# Altium schematic sheet FPGA_CFG.SchDoc
size A4; SheetNumber: 1; SheetTotal: 8
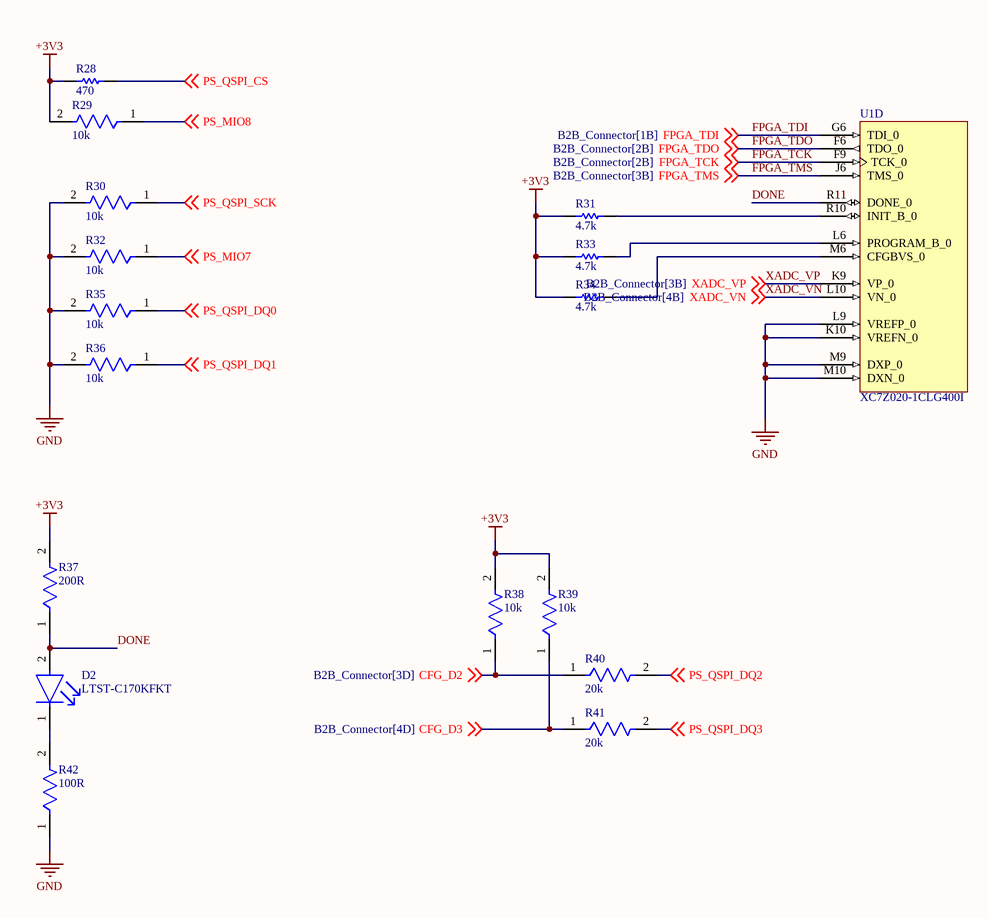
[diagram p0: FPGA_CFG.SchDoc]

## Parts
D2  LTST-C170KFKT  [FP-LTST-C170KFKT-MFG]
R28  470  [RESC1608X55X25LL10T15]
R29  10k  [FP-RC0603-0_55-IPC_C]
R30  10k  [FP-RC0603-0_55-IPC_C]
R31  4.7k  [RESC1608X55X25LL10T15]
R32  10k  [FP-RC0603-0_55-IPC_C]
R33  4.7k  [RESC1608X55X25LL10T15]
R34  4.7k  [RESC1608X55X25LL10T15]
R35  10k  [FP-RC0603-0_55-IPC_C]
R36  10k  [FP-RC0603-0_55-IPC_C]
R37  200R  [FP-ERA3A-IPC_C]
R38  10k  [FP-RC0603-0_55-IPC_C]
R39  10k  [FP-RC0603-0_55-IPC_C]
R40  20k  [FP-RT0603-MFG]
R41  20k  [FP-RT0603-MFG]
R42  100R  [FP-RC0603-0_55-MFG]
U1  XC7Z020-1CLG400I  [CLG400]  (part D of 9)

## Nets
+3V3: R28.2 R29.2 R31.2 R33.2 R34.2 R37.2 R38.2 R39.2
GND: R30.2 R32.2 R35.2 R36.2 R42.1 U1.K10(VREFN_0) U1.L9(VREFP_0) U1.M9(DXP_0) U1.M10(DXN_0)
CFG_D2: R38.1 R40.1 ; off-sheet CFG_D2
CFG_D3: R39.1 R41.1 ; off-sheet CFG_D3
DONE: D2.2(A) R37.1 U1.R11(DONE_0)
FPGA_TCK: U1.F9(TCK_0) ; off-sheet FPGA_TCK
FPGA_TDI: U1.G6(TDI_0) ; off-sheet FPGA_TDI
FPGA_TDO: U1.F6(TDO_0) ; off-sheet FPGA_TDO
FPGA_TMS: U1.J6(TMS_0) ; off-sheet FPGA_TMS
PS_MIO7: R32.1 ; off-sheet PS_MIO7
PS_MIO8: R29.1 ; off-sheet PS_MIO8
PS_QSPI_CS: R28.1 ; off-sheet PS_QSPI_CS
PS_QSPI_DQ0: R35.1 ; off-sheet PS_QSPI_DQ0
PS_QSPI_DQ1: R36.1 ; off-sheet PS_QSPI_DQ1
PS_QSPI_DQ2: R40.2 ; off-sheet PS_QSPI_DQ2
PS_QSPI_DQ3: R41.2 ; off-sheet PS_QSPI_DQ3
PS_QSPI_SCK: R30.1 ; off-sheet PS_QSPI_SCK
XADC_VN: U1.L10(VN_0) ; off-sheet XADC_VN
XADC_VP: U1.K9(VP_0) ; off-sheet XADC_VP
NetD2_1: D2.1(C) R42.2
NetR31_1: R31.1 U1.R10(INIT_B_0)
NetR33_1: R33.1 U1.L6(PROGRAM_B_0)
NetR34_1: R34.1 U1.M6(CFGBVS_0)

## Library data of the parts
D2 = CMP-22017-000036-1: LED ORANGE CLEAR SMD; Forward Current: 30mA; Reverse Voltage: 5V; Forward Voltage: 2V; Lens Style: Diffused; Number of Elements: 1; Test Current: 20mA; Lens Color: Colorless; Viewing Angle: 130°; Dominant Wavelength: 605nm; Luminous Intensity: 60mcd; Power Rating: 75mW; Wavelength: 611nm; Min Operating Temperature: -55°C; Packaging: Tape and Reel; Case Code (Metric): 2012; Depth: 1.6mm; Case Code (Imperial): 0805; Mount: Surface Mount; Radiation Hardening: No; Lens Transparency: Clear; Color: Orange; Package Quantity: 1; Illumination Color: Orange; Lead Free: Lead Free; Number of LEDs: 1; Length: 3.2mm; Height: 1.1mm; Number of Pins: 2; Width: 1.25mm; Case/Package: 0805; Power Dissipation: 75mW; Max Operating Temperature: 85°C
R28 = CMP-1659-00035-2: General Purpose Chip Resistor, 470 Ohm, +/- 1%, -55 to 155 degC, 0603 (1608 Metric), RoHS, Tape and Reel; Resistance: 470 Ohm; ComponentLink1Description: Manufacturer URL; Contact Plating: Gold; Width: 3.1 mm; Radiation Hardening: No; DatasheetVersion: Rev. 4, 04/2009; Length: 3 mm; PackageDescription: 2-Pin Surface Mount Device, Body 1.6 x 0.8 mm; ComponentLink1URL: http://www.yageo.com/; Min Operating Temperature: -40 degC; Mount: Surface Mount; Package Quantity: 2500; ComponentLink2URL: https://datasheet.ciiva.com/11808/0900766b80f96399-11808177.pdf; RoHSCompliant: true; Fastening Type: Snap; PackageReference: 0603; Max Operating Temperature: 90 degC; Height: 1.25 mm; Packaging: Tape and Reel; ComponentLink2Description: Datasheet; Contact Material: Brass
R29 R30 R32 R35 R36 R38 R39 = CMP-2100-03664-2: RES 10K OHM 1% 1/10W 0603; Voltage Rating: 75V; Voltage Rating (DC): 50V; Resistance: 10kR; Power Rating: 100mW; Temperature Coefficient: 100ppm/°C; Depth: 0.8mm; Termination: SMD/SMT; Resistor Type: Thick Film; Series: RC; Construction: Rectangular; Features: Moisture Resistant; Packaging: Tape and Reel; Min Operating Temperature: -55°C; Number of Terminations: 2; Lead Pitch: 0.3mm; RoHS Compliant: Yes; Case/Package: 0603; Resistance Tolerance: 1%; Military Standard: Not; Weight: 7.1E-05oz; Number of Pins: 2; Tolerance: 1%; Length: 1.6mm; Case Code (Imperial): 0603; Lead Free: Lead Free; Width: 0.8mm; Max Power Dissipation: 100mW; Height: 0.45mm; Max Operating Temperature: 155°C; Case Code (Metric): 1608; Size Code: 0603
R31 R33 R34 = CMP-2000-06942-1: Chip Resistor, 4.7 KOhm, +/- 1%, 0.1 W, -55 to 155 degC, 0603 (1608 Metric), RoHS, Tape and Reel; Manufacturer: Yageo; Power Rating: 100mW; Temperature Coefficient: 100PPM/C; Resistance: 4.7kOhms; Voltage Rating: 50V; Package Reference: 0603; Series: RC; Datasheet Version: Rev. 7, 05/2017; Packaging: Reel; Termination Style: SMD/SMT; Datasheet URL: http://www.yageo.com/documents/recent/PYu-RC_Group_51_RoHS_L_7.pdf; Manufacturer URL: http://www.yageo.com/; Package Description: 2-Pin Surface Mount Device, Body 1.6 x 0.8 mm; Case Code - mm: 1608; Case Code - in: 0603; Mounting Technology: SurfaceMount; Operating Temperature Range: -55Cto+155C; Tolerance: 1%; Product: ThickFilmResistorsGeneralPurpose
R37 = CMP-2000-00944-2: RES SMD 200 OHM 0.1% 1/10W 0603; Voltage Rating: 75V; Power Rating: 100mW; Temperature Coefficient: 25ppm/°C; Number of Terminations: 2; Tolerance: 0.1%; Features: Automotive AEC-Q200; Size Code: 0603; Case/Package: 0603; Resistance Tolerance: 0.1%; Contact Plating: Tin; Max Operating Temperature: 155°C; Depth: 0.8mm; Resistance: 200R; Height: 0.45mm; Resistor Type: Thin Film; Length: 1.6mm; REACH SVHC: No SVHC; Mount: Surface Mount; Voltage Rating (DC): 75V; Termination: SMD/SMT; Military Standard: Not; RoHS Compliant: Yes; Construction: Rectangular; Min Operating Temperature: -55°C; Case Code (Imperial): 0603; Width: 0.8mm; Max Power Dissipation: 100mW; Number of Pins: 2; Radiation Hardening: No; Packaging: Tape and Reel; Case Code (Metric): 1608; Lead Free: Lead Free; Technology: THIN FILM; Series: ERA-3A; Package Quantity: 1
R40 R41 = CMP-2000-04399-2: RES SMD 20K OHM 0.1% 1/10W 0603; Manufacturer: Yageo; Manufacturer Part Number: RT0603BRD0720KL; Value: 20KΩ; Temperature Coefficient: 25 ppm/°C; Tolerance: 0.001; Power Rating: 0.1W; Voltage Rating: 75V; Package: RT0603; Lead Free: Yes; Device Class L2: Resistors; Octopart: https://octopart.com/rt0603brd0720kl-yageo-1382430; Composition: Thin Film; Device Class L1: Passive Components; Temperature: -55°C to +155°C; Temperature Range High: +155°C; Series: RT; Footprint Url: http://www.yageo.com/exep/pages/download/literatures/PYu-R_Mount_10.pdf; Height: 0.55mm; Ipc Land Pattern Name: RESC16080X45; Temperature Range Low: -55°C; ComponentLink2URL: http://www.yageo.com/documents/recent/PYu-RT_1-to-0.01_RoHS_L_9.pdf; Digikey Description: RES SMD 20K OHM 0.1% 1/10W 0603; Device Class L3: Chip SMD Resistors; Resistance: 20KΩ; Automotive: No; Category: Res; Mouser Description: High Precision-High Stability Chip Resistor Thin Film 0603 20kOhm 0.1% Paper T/R; RoHS: TRUE; ComponentLink2Description: Datasheet
R42 = CMP-2100-03663-2: NexarPartId: 55402879; Voltage Rating: 50V; Power Rating: 100mW; Tolerance: 1%; Temperature Coefficient: 100ppm/°C; Resistance: 100Ω; Case/Package: 0603; Military Standard: Not; REACH SVHC: Unknown; Case Code (Metric): 0603; Max Operating Temperature: 155°C; Schedule B: 8533210045, 8533210045; Height: 450µm; Length: 1.6mm; Lead Free: Lead Free; Packaging: Tape & Reel; Case Code (Imperial): 0603; Composition: Thick Film; Min Operating Temperature: -55°C; Voltage Rating (DC): 50V; RoHS: Compliant; Depth: 800µm; Number of Pins: 2; Termination: SMD/SMT; Width: 800µm
U1 = CMP-0363-00001-3: 667 MHz Zynq™-7000 AP SoC, 130 PS I/O, 125 FPGA I/O, 400-Ball BGA, Speed Grade 1, Industrial Grade, Pb-Free; LUTs: 53200; Flip Flops: 106400; Extensible Block RAM (# 36Kb Blocks): 560 KB (140); Speed Grade: -1; RoHS: Pb-Free; ComponentLink3Description: DC and AC Switching Characteristics; ComponentLink6Description: PCB and Layout Guide; ComponentLink1Description: Datasheet; ComponentLink4URL: http://www.xilinx.com/support/packagefiles/z7packages/xc7z020clg400pkg.txt; ComponentLink2Description: Package Specification; PackageReference: CLG400; ComponentLink4Description: Package File; Generic Part Number: XC7Z020; ComponentLink6URL: http://www.xilinx.com/support/documentation/user_guides/ug483_7Series_PCB.pdf; PackageVersion: Rev 1.1, 09/2012; PartNumber: XC7Z020-1CLG400I; PackageDescription: Wire-Bond Chip-Scale BGA, Body 17 x 17 mm, 0.8 mm Pitch; ComponentLink5Description: Packaging and Pinout; ComponentLink2URL: http://www.xilinx.com/support/documentation/user_guides/ug865-Zynq-7000-Pkg-Pinout.pdf; ComponentLink5URL: http://www.xilinx.com/support/documentation/user_guides/ug865-Zynq-7000-Pkg-Pinout.pdf; DatasheetVersion: v1.2; Code_JEDEC: MO-275-MMAA-1; Mounting Technology: Surface Mount; ComponentLink3URL: http://www.xilinx.com/support/documentation/data_sheets/ds187-XC7Z010-XC7Z020-Data-Sheet.pdf; ComponentLink1URL: http://www.xilinx.com/support/documentation/data_sheets/ds190-Zynq-7000-Overview.pdf